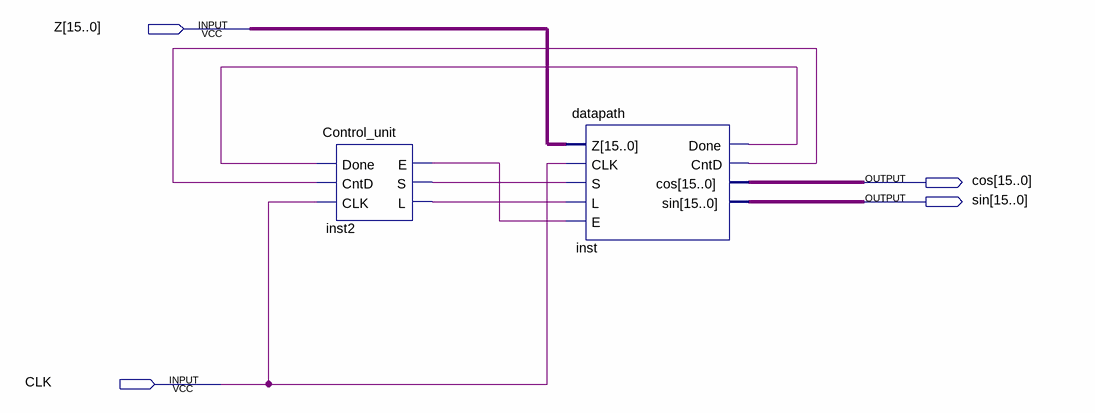
[diagram p0: schematic sheet]
// Quartus schematic SinCosCalculator.bdf as structural Verilog: 2 symbols, 4 pins
module SinCosCalculator (
  input  [15:0] Z,
  input  CLK,
  output [15:0] cos,
  output [15:0] sin
);

  wire inst2_e, inst2_l, inst2_s, inst_cntd, inst_done;

  Control_unit inst2 (.Done(inst_done), .CntD(inst_cntd), .CLK(CLK), .E(inst2_e), .S(inst2_s), .L(inst2_l));
  datapath inst (
    .Z(Z), .CLK(CLK), .S(inst2_s), .L(inst2_l), .E(inst2_e), .Done(inst_done), .CntD(inst_cntd), .cos(cos),
    .sin(sin));
endmodule
